# EAGLE design AirSpark_0.9 (EAGLE 7.2.0)
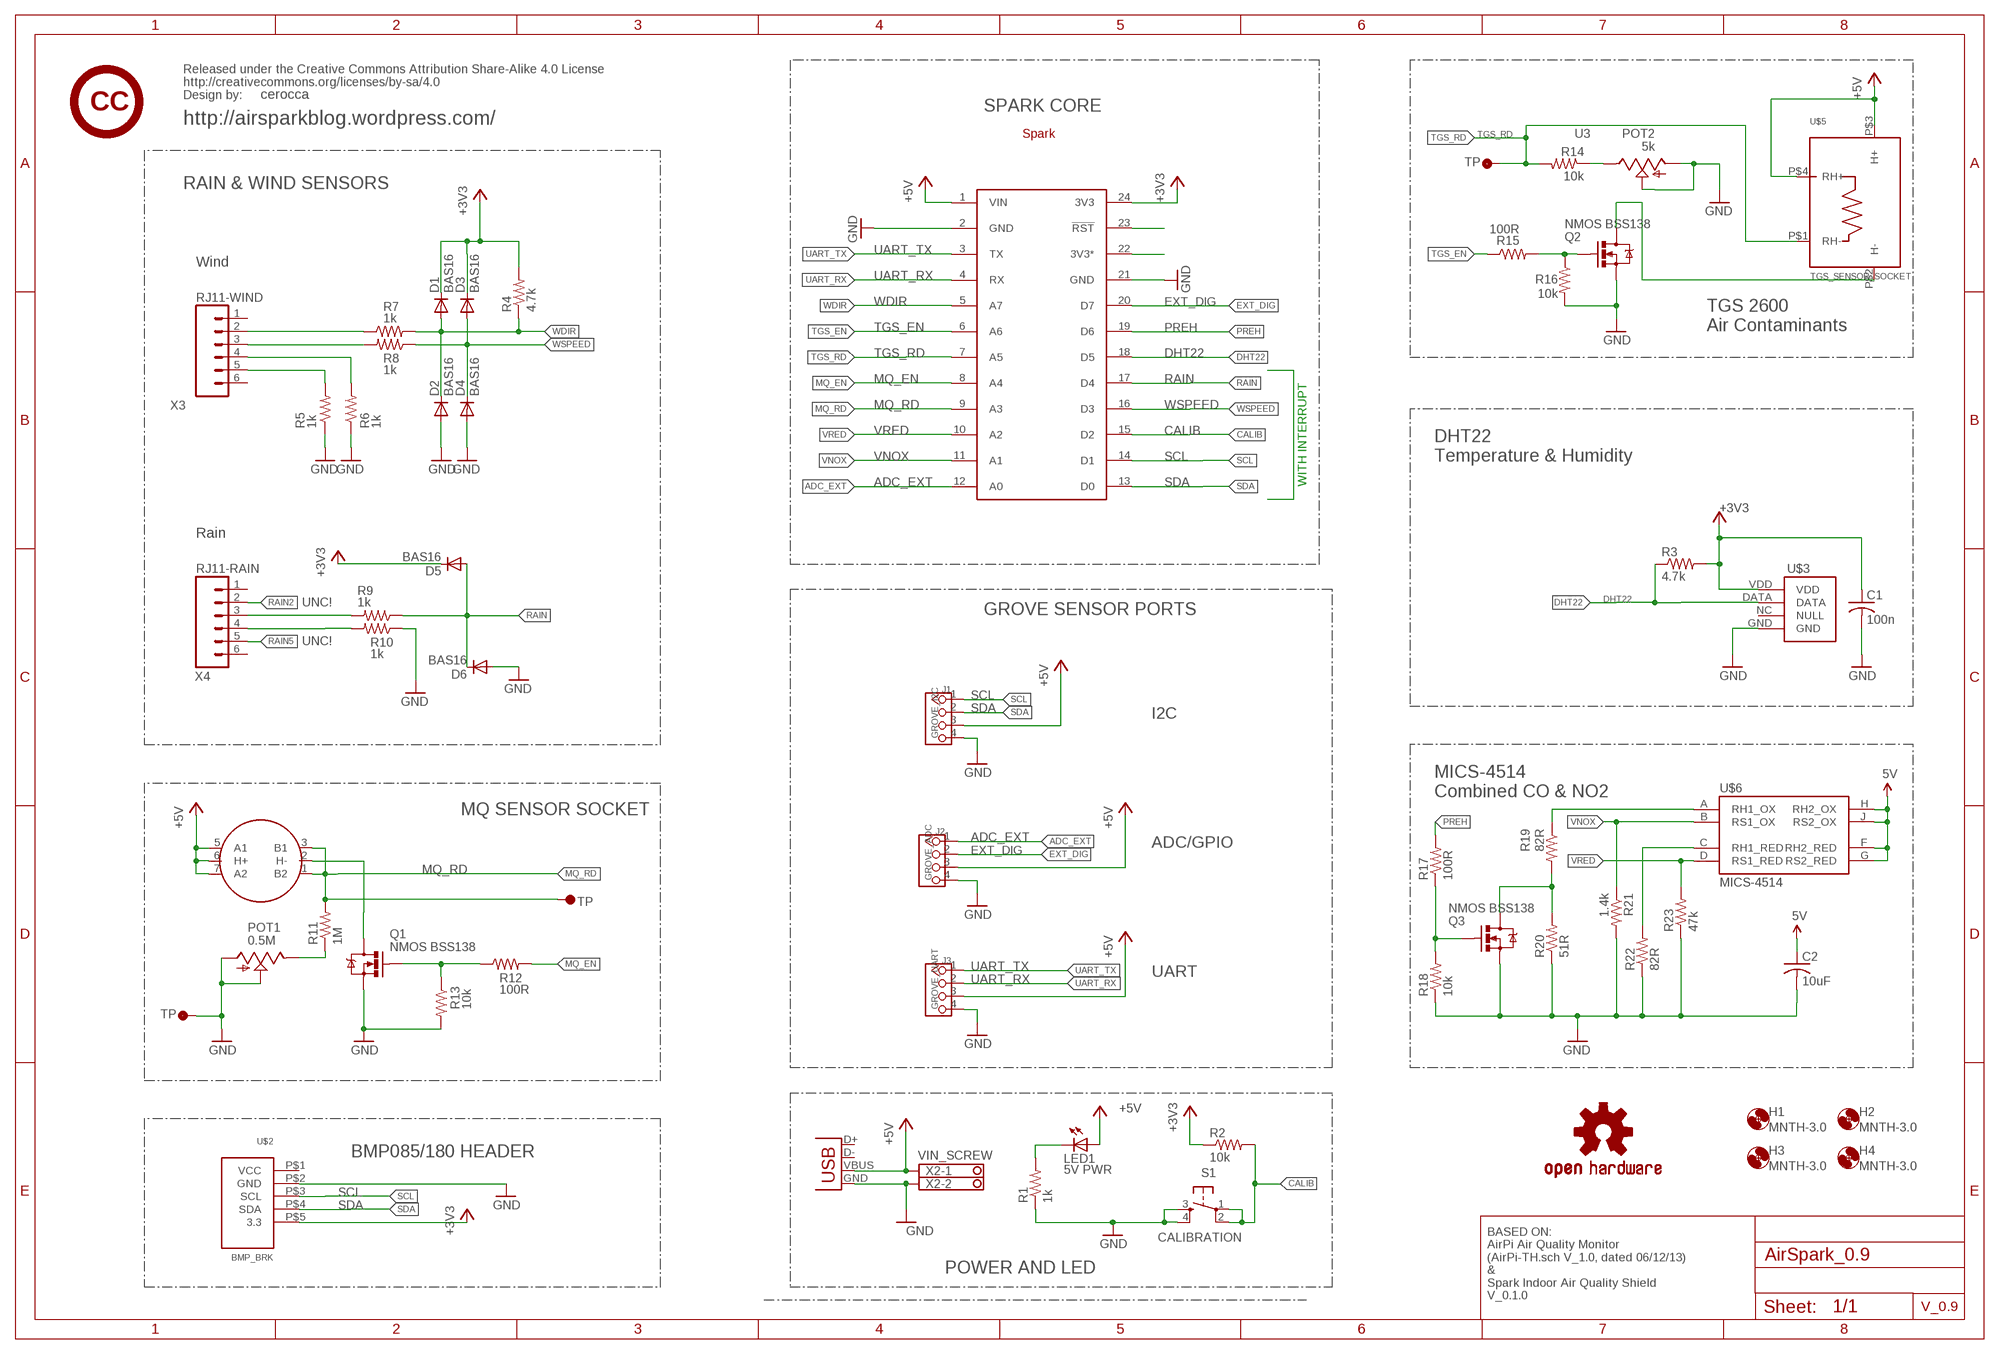
[diagram p0: schematic, sheet 1]

## Parts
C1  100n  C-USC0603  [C0603]
C2  10uF  C-USC0603  [C0603]
D1  BAS16  DIODESOD  [SOD-323]
D2  BAS16  DIODESOD  [SOD-323]
D3  BAS16  DIODESOD  [SOD-323]
D4  BAS16  DIODESOD  [SOD-323]
D5  BAS16  DIODESOD  [SOD-323]
D6  BAS16  DIODESOD  [SOD-323]
H1  MNTH-3.0  MOUNT-HOLE3.0  [3,0]
H2  MNTH-3.0  MOUNT-HOLE3.0  [3,0]
H3  MNTH-3.0  MOUNT-HOLE3.0  [3,0]
H4  MNTH-3.0  MOUNT-HOLE3.0  [3,0]
J1  GROVE_I2C  TWIG-4P-2.0-2.0  [4P-2.0]
J2  GROVE_ADC  TWIG-4P-2.0-2.0  [4P-2.0]
J3  GROVE_UART  TWIG-4P-2.0-2.0  [4P-2.0]
LED1  5V PWR  LED3MM  [LED3MM]
LOGO101  OSHW-LOGOL  [OSHW-LOGO-L]
POT1  0.5M  TRIM_US-B25P  [B25P]
POT2  5k  TRIM_US-B25P  [B25P]
Q1  NMOS BSS138  MOSFET-NCHANNELSMD  [SOT23-3]
Q2  NMOS BSS138  MOSFET-NCHANNELSMD  [SOT23-3]
Q3  NMOS BSS138  MOSFET-NCHANNELSMD  [SOT23-3]
R1  1k  R-US_R0603  [R0603]
R2  10k  R-US_R0603  [R0603]
R3  4.7k  R-US_R0603  [R0603]
R4  4.7k  R-US_R0603  [R0603]
R5  1k  R-US_R0603  [R0603]
R6  1k  R-US_R0603  [R0603]
R7  1k  R-US_R0603  [R0603]
R8  1k  R-US_R0603  [R0603]
R9  1k  R-US_R0603  [R0603]
R10  1k  R-US_R0603  [R0603]
R11  1M  R-US_R0603  [R0603]
R12  100R  R-US_R0603  [R0603]
R13  10k  R-US_R0603  [R0603]
R14  10k  R-US_R0603  [R0603]
R15  100R  R-US_R0603  [R0603]
R16  10k  R-US_R0603  [R0603]
R17  100R  R-US_R0603  [R0603]
R18  10k  R-US_R0603  [R0603]
R19  82R  R-US_R0603  [R0603]
R20  51R  R-US_R0603  [R0603]
R21  1.4k  R-US_R0603  [R0603]
R22  82R  R-US_R0603  [R0603]
R23  47k  R-US_R0603  [R0603]
S1  CALIBRATION  TAC_SWITCHPTH  [TACTILE-PTH]
U$1  SPARK_CORECORE  [SPARK_CORE]
U$2  BMP_BRK  [BMP_BRK]
U$3  DHT22  [DHT22]
U$4  MQ_SENSOR_SOCKET  [MQ_SENSOR_SOCKET]
U$5  TGS_SENSOR_SOCKET  TGS  [SR6]
U$6  MICS-4514  [MICS_10-SMD]
U$7  MQ_TP  TESTPAD-PTR  [TESTPAD-PTR]
U$8  TGS_TP  TESTPAD-PTR  [TESTPAD-PTR]
U$9  GND_TP  TESTPAD-PTR  [TESTPAD-PTR]
U$101  CC  [CC]
U$102  CREATIVE_COMMONS  [CREATIVE_COMMONS]
U$103  SPARK_LOGO..  [SPARK_LOGO]
X1  USB-SMD-NS  [USB-MINIB-NOSTOP]
X2  VIN_SCREW  1751248  [1751248]
X3  RJ11-WIND  RJ11-6PTH  [RJ11-6]
X4  RJ11-RAIN  RJ11-6PTH  [RJ11-6]

## Nets
+3V3: C1.1 D1.1(C) D3.1(C) D5.1(C) R2.1 R3.2 R4.2 U$1.24(3V3) U$2.P$5(3.3) U$3.VDD
+5V: C2.1 J1.3 J2.3 J3.3 LED1.A U$1.1(VIN) U$4.5(A1) U$4.6(H+) U$4.7(A2) U$5.P$3(H+) U$5.P$4(RH+) U$6.F(RH2_RED) U$6.G(RS2_RED) U$6.H(RH2_OX) U$6.J(RS2_OX) X1.VBUS X2.1 ; supply symbol labelled 5V
ADC_EXT: J2.1 U$1.12(A0)
CALIB: R2.2 S1.1 S1.2 U$1.15(D2)
DHT22: R3.1 U$1.18(D5) U$3.DATA
EXT_DIG: J2.2 U$1.20(D7)
GND: C1.2 C2.2 D2.2(A) D4.2(A) D6.2(A) J1.4 J2.4 J3.4 POT1.A POT1.S POT2.A POT2.S Q1.2(S) Q2.2(S) Q3.2(S) R1.1 R5.1 R6.1 R10.1 R13.2 R16.2 R18.1 R20.1 R21.2 R22.1 R23.1 S1.3 S1.4 U$1.2(GND) U$1.21(GND) U$2.P$2(GND) U$3.GND U$9.TP X1.GND X2.2
MQ_EN: R12.2 U$1.8(A4)
MQ_RD: R11.2 U$1.9(A3) U$4.1(B2) U$4.3(B1) U$7.TP
N$1: R19.1 U$6.A(RH1_OX)
N$2: POT2.E R14.1
N$3: Q3.1(G) R17.1 R18.2
N$4: R22.2 U$6.C(RH1_RED)
N$6: Q3.3(D) R19.2 R20.2
N$7: Q1.3(D) U$4.2(H-)
N$8: Q2.3(D) U$5.P$2(H-)
N$10: Q1.1(G) R12.1 R13.1
N$18: LED1.K(C) R1.2
N$19: Q2.1(G) R15.2 R16.1
N$29: POT1.E R11.1
N$34: R7.1 X3.2
N$35: R8.2 X3.3
N$36: R9.2 X4.3
N$37: R10.2 X4.4
N$38: R5.2 X3.5
N$39: R6.2 X3.4
N$48: U$1.23(!RST)
N$49: U$1.22(3V3*)
PREH: R17.2 U$1.19(D6)
RAIN: D5.2(A) D6.1(C) R9.1 U$1.17(D4)
RAIN2: X4.2
RAIN5: X4.5
SCL: J1.1 U$1.14(D1) U$2.P$3(SCL)
SDA: J1.2 U$1.13(D0) U$2.P$4(SDA)
TGS_EN: R15.1 U$1.6(A6)
TGS_RD: R14.2 U$1.7(A5) U$5.P$1(RH-) U$8.TP
UART_RX: J3.2 U$1.4(RX)
UART_TX: J3.1 U$1.3(TX)
VNOX: R21.1 U$1.11(A1) U$6.B(RS1_OX)
VRED: R23.2 U$1.10(A2) U$6.D(RS1_RED)
WDIR: D1.2(A) D2.1(C) R4.1 R7.2 U$1.5(A7)
WSPEED: D3.2(A) D4.1(C) R8.1 U$1.16(D3)
Unconnected: U$2.P$1(VCC) U$3.NC(NULL) X1.D+ X1.D- X3.1 X3.6 X4.1 X4.6

## Notes on the sheet
- cerocca
- SPARK CORE
- http://airsparkblog.wordpress.com/
- U3
- RAIN & WIND SENSORS
- Wind
- TGS 2600
  Air Contaminants
- DHT22
  Temperature & Humidity
- WITH INTERRUPT
- Rain
- U$3
- UNC!
- GROVE SENSOR PORTS
- UNC!
- I2C
- MICS-4514
  Combined CO & NO2
- MQ SENSOR SOCKET
- ADC/GPIO
- UART
- BMP085/180 HEADER
- POWER AND LED
- BASED ON:
  AirPi Air Quality Monitor
  (AirPi-TH.sch V_1.0, dated 06/12/13)
  &
  Spark Indoor Air Quality Shield
  V_0.1.0
- V_0.9

## Library data of the parts
C1 C2 = AirSpark:C-US: CAPACITOR, American symbol
D1-D6 = AirSpark:DIODE: Diode These are standard reverse protection diodes and small signal diodes. SMA package can handle up to about 1A. SOD-323 can handle about 200mA. What the SOD-323 package when ordering, there are some mfgs out there that are 5-pin packages.
H1-H4 = AirSpark:MOUNT-HOLE: MOUNTING HOLE with drill center marker
J1-J3 = AirSpark:TWIG-4P-2.0
LED1 = AirSpark:LED: LED OSRAM: - CHIPLED LG R971, LG N971, LY N971, LG Q971, LY Q971, LO R971, LY R971 LH N974, LH R974 LS Q976, LO Q976, LY Q976 LO Q996 - Hyper CHIPLED LW Q18S LB Q993, LB Q99A, LB R99A - SideLED LS A670, LO A670, LY A670, LG A670, LP A670 LB A673, LV A673, LT A673, LW A673 LH A674 LY A675 LS A676, LA A676, LO A676, LY A676, LW A676 LS A679, LY A679, LG A679 - Hyper Micro SIDELED® LS Y876, LA Y876, LO Y876, LY Y876 LT Y87S - SmartLED LW L88C, LW L88S LB L89C, LB L89S, LG L890 LS L89K, LO L89K, LY L89K LS L896, LA L896, LO L896, LY L896 - TOPLED LS T670, LO T670, LY T670, LG T670, LP T670 LSG T670, LSP T670, LSY T670, LOP T670, LYG T670 LG T671, LOG T671, LSG T671 LB T673, LV T673, LT T673, LW T673 LH T674 LS T676, LA T676, LO T676, LY T676, LB T676, LH T676, LSB T676, LW T676 LB T67C, LV T67C, LT T67C, LS T67K, LO T67K, LY T67K, LW E67C LS E67B, LA E67B, LO E67B, LY E67B, LB E67C, LV E67C, LT E67C LW T67C LS T679, LY T679, LG T679 LS T770, LO T770, LY T770, LG T770, LP T770 LB T773, LV T773, LT T773, LW T773 LH T774 LS E675, LA E675, LY E675, LS T675 LS T776, LA T776, LO T776, LY T776, LB T776 LHGB T686 LT T68C, LB T68C - Hyper Mini TOPLED® LB M676 - Mini TOPLED Santana® LG M470 LS M47K, LO M47K, LY M47K Source: http://www.osram.convergy.de/
LOGO101 = AirSpark:OSHW-LOGO: Open Source Hardware Logo This logo indicates the piece of hardware it is found on incorporates a OSHW license and/or adheres to the definition of open source hardware found here: http://freedomdefined.org/OSHW
POT1 POT2 = AirSpark:TRIM_US-: POTENTIOMETER
Q1-Q3 = AirSpark:MOSFET-NCHANNEL
R1-R23 = AirSpark:R-US_: RESISTOR, American symbol
S1 = AirSpark:TAC_SWITCH: Momentary Switch Button commonly used for reset or general input. Spark Fun Electronics SKU : COM-00097
U$1 = AirSpark:SPARK_CORE
U$2 = AirSpark:BMP_BRK
U$3 = AirSpark:DHT22
U$4 = AirSpark:MQ_SENSOR_SOCKET
U$5 = AirSpark:TGS
U$6 = AirSpark:MICS-4514: Metal oxide MEMS carbon monoxide (CO) and NOx sensor in an SMD package.; PROD_ID: COMP-12310
U$7-U$9 = AirSpark:TESTPAD-PTR
U$101 = AirSpark:CC
U$102 = AirSpark:CREATIVE_COMMONS
U$103 = AirSpark:SPARK_LOGO
X1 = AirSpark:USB
X2 = AirSpark:1751248: MKDS 1/ 2-3,5 Printklemme Nennstrom: 10 A Bemessungsspannung: 160 V Raster: 3,5 mm Polzahl: 2 Montageart: Löten Anschlussart: Schraubanschluss Anschlussrichtung vom Leiter zur Platine: 0° Source: http://eshop.phoenixcontact.com .. 1751248.pdf; OC_FARNELL: unknown; OC_NEWARK: unknown
X3 X4 = AirSpark:RJ11-6: RJ11 Jack Simple 6 pin RJ11 jack. Commonly found on CAT3 devices and Microchip programmers. SKU: PRT-00132

## Net classes
0 Default: width 0.203 mm
1 power: width 0.203 mm, clearance 0.152 mm

## Board
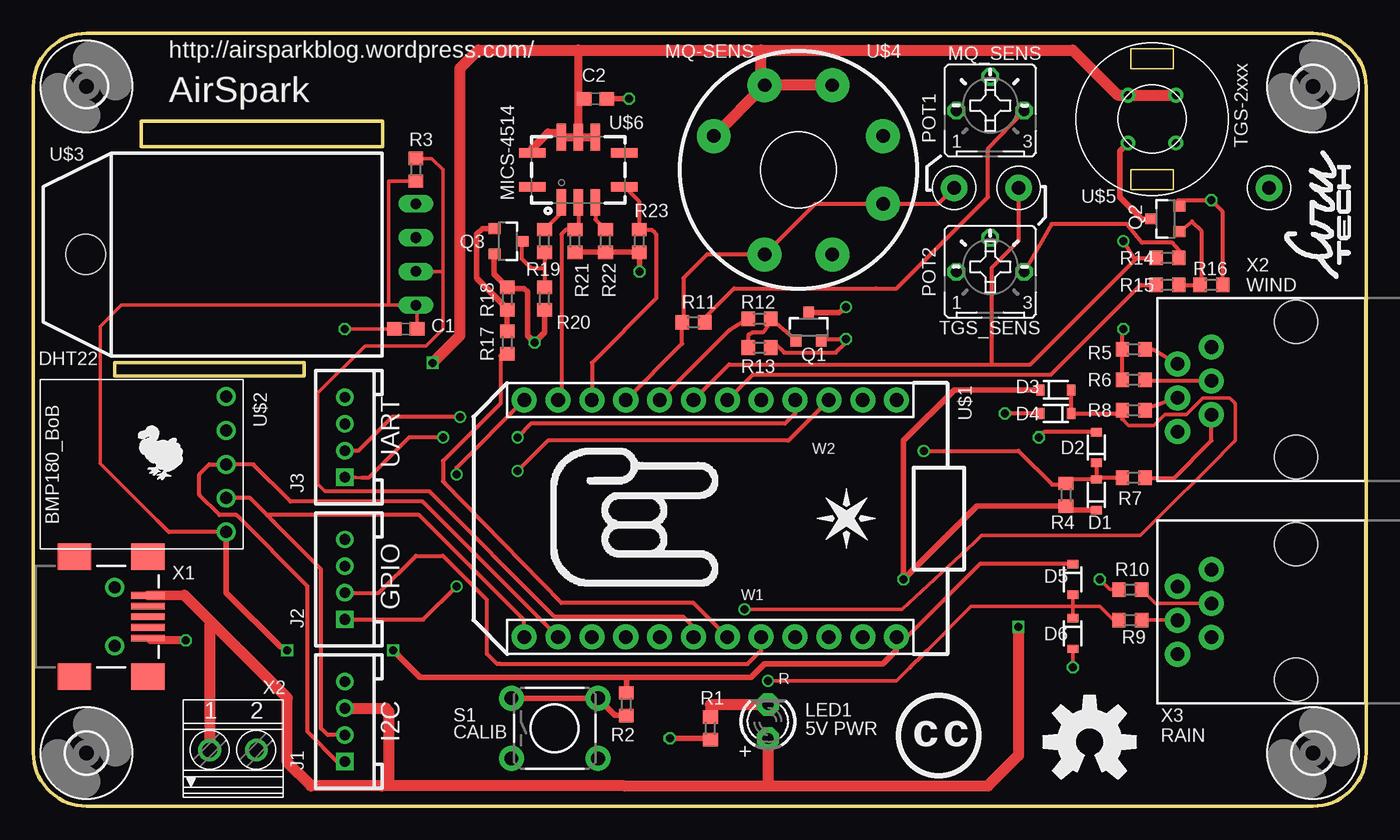
[diagram p1: board, top side]
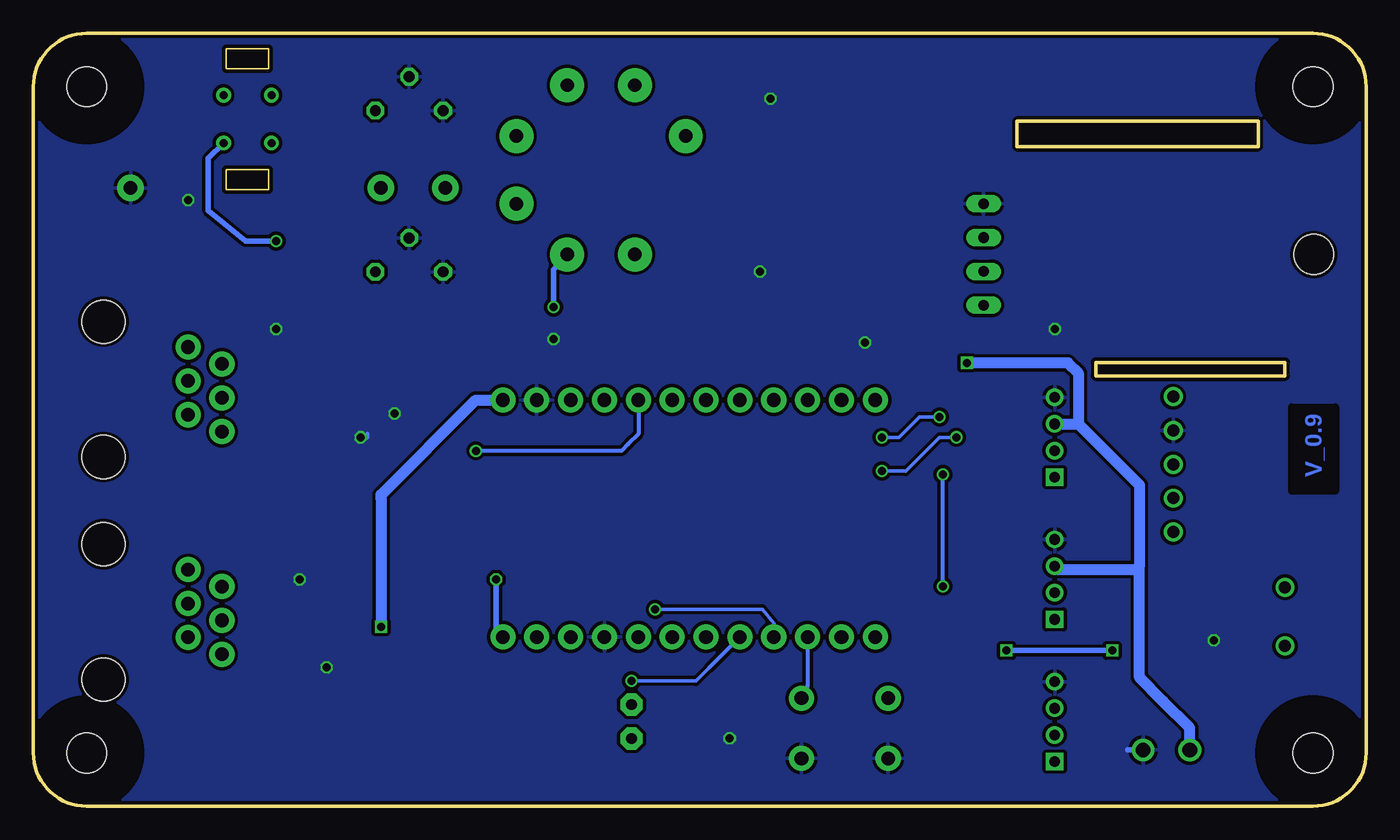
[diagram p2: board, bottom side, seen from below]

Size 100 x 58 mm. Coordinates in mm from the lower left corner, seen from the top.
Outline: 4,0 96,0 arc90 100,4 100,54 arc90 96,58 4,58 arc90 0,54 0,4 arc90 4,0
Outline: 8.1,51.4 26.2,51.4 26.2,49.5 8.1,49.5 8.1,51.4
Outline: 6.1,33.3 20.3,33.3 20.3,32.3 6.1,32.3 6.1,33.3
Copper layers (1*16): Top 0.035mm / dielectric 1.5mm / Bottom 0.035mm
Design rules "SeeedStudio_2layer_DRU_no_angle_20140221": minimum track width 6mil, minimum drill 12mil, track to track 6mil, track to pad 6mil, pad to pad 6mil, via to via 6mil, smd to smd 0mil, copper to edge 10mil, drill to drill 10mil, minimum pad ring 10mil, minimum via ring 6mil, stop-mask expansion 2mil, vias tented up to drill 100mil, thermal gap 10mil
bRestrict: area 2.3,23.6 to 5.6,30

### Footprints (pad centres in the part's own frame; a part is rotated, then mirrored left to right if it is on the bottom)
C0603 = smd 1.1 x 1: 1 -0.85,0; 2 0.85,0
SOD-323 = smd 0.63 x 0.83: 1 -1.15,0; 2 1.15,0
3,0 = hole 3: 0,0
4P-2.0 = drill 0.8 pad 1.27 square: 1 -3,0 | drill 0.8 pad 1.27: 2 -1,0; 3 1,0; 4 3,0
LED3MM = drill 0.813 pad 1.676 octagon: A -1.27,0; K 1.27,0
B25P = drill 0.813 octagon: A -2.54,0; E 2.54,0; S 0,2.54
SOT23-3 = smd 0.8 x 0.9: 1 -0.95,-1; 2 0.95,-1; 3 0,1.1
R0603 = smd 1 x 1.1: 1 -0.85,0; 2 0.85,0
TACTILE-PTH = drill 1.016 pad 1.88: 1 -3.251,2.261; 2 3.251,2.261; 3 -3.251,-2.261; 4 3.251,-2.261
SPARK_CORE = drill 1.016 pad 1.88: 1 -8.89,13.97; 2 -8.89,11.43; 3 -8.89,8.89; 4 -8.89,6.35; 5 -8.89,3.81; 6 -8.89,1.27; 7 -8.89,-1.27; 8 -8.89,-3.81; 9 -8.89,-6.35; 10 -8.89,-8.89; 11 -8.89,-11.43; 12 -8.89,-13.97; 13 8.89,-13.97; 14 8.89,-11.43; 15 8.89,-8.89; 16 8.89,-6.35; 17 8.89,-3.81; 18 8.89,-1.27; 19 8.89,1.27; 20 8.89,3.81; 21 8.89,6.35; 22 8.89,8.89; 23 8.89,11.43; 24 8.89,13.97
BMP_BRK = drill 0.9: P$1 1.27,1.27; P$2 1.27,3.81; P$3 1.27,6.35; P$4 1.27,8.89; P$5 1.27,11.43
DHT22 = drill 0.8 long: DATA -1.27,0; GND 3.81,0; NC 1.27,0; VDD -3.81,0 | hole 3: 0,24.765
MQ_SENSOR_SOCKET = drill 1 pad 2.54: 1 6.35,-2.54; 2 6.35,2.54; 3 2.54,6.35; 4 -2.54,6.35; 5 -6.35,2.54; 6 -6.35,-2.54; 7 -2.54,-6.35
SR6 = drill 0.6: P$1 1.795,1.795; P$2 1.795,-1.795; P$3 -1.795,-1.795; P$4 -1.795,1.795
MICS_10-SMD = smd 0.7 x 2: A 1.27,2.45; B 0,2.45; C -1.27,2.45; F -1.27,-2.45; G 0,-2.45; H 1.27,-2.45 | smd 2 x 0.7: D -3.45,1.27; E -3.45,-1.27; J 3.45,-1.27; K 3.45,1.27
TESTPAD-PTR = drill 1 pad 2: TP 0,0
USB-MINIB-NOSTOP = smd 2.5 x 0.5: D+ 2.5,0; D- 2.5,0.8; GND 2.5,-1.6; ID 2.5,-0.8; VBUS 2.5,1.6 | smd 2.5 x 2: G1 -3,-4.5; G2 -3,4.5; G3 2.5,4.5; G4 2.5,-4.5 | drill 0.9 pad 0.8: H1 0,2.2 | drill 0.9 pad 0.787: H2 0,-2.2
1751248 = drill 1.1 pad 1.7: 1 -1.75,-0.1; 2 1.75,-0.1
RJ11-6 = drill 1.016 pad 1.88: 1 1.905,8.89; 2 3.175,6.35; 3 4.445,8.89; 4 5.715,6.35; 5 6.985,8.89; 6 8.255,6.35 | hole 3.251: 0,0; 10.16,0

### Placement (x,y rotation side)
C1  27.94,35.81 180 top
C2  42.16,53.09 0 top
D1  79.76,23.37 90 top
D2  79.76,26.92 90 top
D3  76.71,31.24 0 top
D4  76.71,29.46 180 top
D5  77.98,17.02 270 top
D6  77.98,12.95 270 top
H1  4,4 0 top
H2  96,4 0 top
H3  96,54 0 top
H4  4,54 0 top
J1  23.37,6.35 90 top
J2  23.37,17.02 90 top
J3  23.37,27.69 90 top
LED1  55.12,6.35 90 top
LOGO101  79.25,4.83 0 top
POT1  71.8,52.2 0 top
POT2  71.8,40.1 0 top
Q1  58.17,35.94 0 top
Q2  84.96,44.07 90 top
Q3  35.6,42.4 270 top
R1  50.8,5.84 90 top
R2  44.49,7.66 270 top
R3  28.7,47.75 270 top
R4  77.47,23.37 270 top
R5  82.55,34.29 0 top
R6  82.55,32 0 top
R7  82.55,24.64 180 top
R8  82.55,29.72 0 top
R9  82.3,13.97 0 top
R10  82.3,16.26 0 top
R11  49.53,36.32 180 top
R12  54.48,36.58 180 top
R13  54.48,34.42 0 top
R14  85.09,41.15 180 top
R15  85.09,39.12 0 top
R16  88.39,39.12 0 top
R17  35.56,34.8 270 top
R18  35.56,38.1 270 top
R19  38.35,42.42 270 top
R20  38.35,38.1 90 top
R21  40.64,42.42 270 top
R22  42.93,42.42 90 top
R23  45.47,42.42 90 top
S1  39.12,5.84 0 top
U$1  50.8,21.59 270 top
U$2  15.75,32 180 top
U$3  28.7,41.4 90 top
U$4  57.4,47.75 270 top
U$5  83.93,51.56 270 top
U$6  40.89,47.75 180 top
U$7  69.09,46.4 0 top
U$8  73.91,46.4 0 top
U$9  92.71,46.4 0 top
U$12  [DOD]  7.37,24.38 0 top
U$101  67.82,5.33 0 top
U$102  20.83,-7.62 0 top  (outside the outline)
U$103  58.72,19.28 0 top
U$104  [CIRU_1X05]  99.6,39.14 90 top
U$105  [ROCKIT]  38.73,26.97 270 top
X1  6.1,14.22 0 top
X2  14.99,4.32 0 top
X3  94.74,26.2 90 top
X4  94.74,9.5 90 top

### Tracks (layer width: path | path; a pad name or v marks a point on that pad's centre or on a via)
+3V3  (via drill 0.6)
  Top 0.254: 9.27,21.46 5,25.73 5,36 6.6,37.6 6.6,37.59 26.67,37.59 | 26.67,37.59 U$3.VDD 28.79,37.5 C1.1 | R3.2 26.67,46.9 26.67,37.59
  Top 0.305: U$2.P$5 10.16,20.57 9.27,21.46 | D5.1 71,18.17 65.53,12.7 U$1.24
  Top 0.406: 64.77,11.94 64.77,11.68 | 64.77,11.68 64.77,11.94 | 44.7,9.65 53.85,9.65 54.86,10.67 62.74,10.67 63.75,10.67 64.77,11.68 | 44.7,9.65 33.53,9.65 29.02,9.65 v26.98,11.68 | v19.05,11.68 18.54,11.94 14.48,16 U$2.P$5 | R2.1 44.49,9.44 44.7,9.65 | D1.1 77.77,22.22 R4.2 70.78,22.52 v65.28,17.02 65.28,27.43 69.09,31.24 D3.1 | 64.77,11.94 U$1.24
  Bottom 0.406: v26.98,11.68 23.11,11.68 19.81,11.68 v19.05,11.68 | v65.28,17.02 65.28,13.21 U$1.24
+5V  (via drill 0.6)
  Top 0.305: 74.17,9.14 73.91,8.89
  Top 0.61: U$6.G U$6.H 39.53,50.55 38.61,50.55 37.44,49.38 U$6.J | U$6.G 40.89,52.67 | 40.89,52.67 C2.1 | 40.89,52.67 40.89,56.74 | U$6.G U$6.F | 52.48,56.74 50.8,56.74
  Top 0.711: X1.VBUS 11.35,15.82
  Top 0.813: 13.46,4.44 X2.1 13.24,13.94 12.95,14.22 | v29.97,33.27 32,35.31 32,55.37 33.37,56.74 40.89,56.74 50.8,56.74 52.48,56.74 54.61,56.74 | 54.61,56.74 77.98,56.74 81.36,53.36 U$5.P$3 U$5.P$4 | 26.16,1.52 44.36,1.52 45.47,1.52 55.12,1.52 | 26.16,1.52 20.83,1.52 19.05,3.3 19.05,8.13 12.95,14.22 | 11.35,15.82 12.95,14.22 | 55.12,1.52 71.63,1.52 73.91,3.81 73.91,6.86 73.91,8.89 v73.91,13.46 | LED1.A 55.12,1.52 | J1.3 26.43,7.35 26.67,7.11 26.67,2.03 26.16,1.52 | U$4.6 U$4.7 | U$4.5 U$4.6 | U$4.6 54.61,54.36 54.61,56.74
  Bottom 0.813: X2.1 13.24,5.87 15.24,7.87 17.02,9.65 17.02,18.03 | v29.97,33.27 23.38,33.27 22.37,33.27 21.6,32.51 21.6,28.69 | J2.3 23.13,17.78 17.27,17.78 17.02,18.03 | U$1.1 66.8,30.48 73.91,23.37 73.91,23.11 v73.91,13.46 | J3.3 21.6,28.69 | 21.6,28.69 17.02,24.1 17.02,18.03
ADC_EXT  (via drill 0.6)
  Top 0.305: J2.1 29.26,14.02 v31.75,16.51 | v31.75,24.89 31.75,25.4 U$1.12
  Bottom 0.305: v31.75,16.51 v31.75,24.89
CALIB
  Top 0.406: S1.1 S1.2 43.66,6.81 R2.2
  Bottom 0.305: U$1.15 41.91,9.07 S1.2
DHT22
  Top 0.254: U$3.DATA 30.73,40.13 | 30.73,40.13 30.73,35.81 29.46,34.54 24.89,34.54 21.34,30.99 21.34,25.54 21.34,24.19 21.9,23.62 | 30.73,40.13 30.73,47.24 30.73,47.75 29.88,48.6 R3.1 28.83,48.73
  Top 0.305: U$1.18 49.53,13.46 48.77,14.22 39.12,14.22 29.72,23.62 21.9,23.62
EXT_DIG
  Top 0.305: U$1.20 54.61,11.68 53.59,10.67 35.05,10.67 34.8,10.67 34.04,11.43 34.04,15.49 30.73,18.8 28.7,18.8 25.92,16.02 J2.2
GND  (via drill 0.6)
  Top 0.254: D6.2 v77.98,10.41 | R10.1 80.77,16.26 v80.01,17.02 | C1.2 v23.37,35.81
  Top 0.305: R6.1 R5.1 81.7,35.73 v81.79,35.81 | D4.2 v72.9,29.46 | Q1.2 59.13,35.05 v60.96,35.05 60.96,34.8 60.2,34.04 59.94,34.04 56.35,34.04 55.59,34.8 R13.2 | Q2.2 85.9,45.47 v88.39,45.47 89.24,44.62 R16.2 | D2.2 75.81,28.07 v75.44,27.69
  Top 0.406: v47.75,5.08 50.8,5.08 R1.1 | R23.1 R22.1 R21.2 45.3,41.57 45.47,41.4 v45.47,40.13 | C2.2 v44.7,53.09 | R20.1 38.35,35.56 v37.59,34.8 37.08,35.31 37.08,35.81 37.08,38.61 36.83,38.86 35.65,38.86 R18.1 34.56,39.95 34.56,41.41 Q3.2
  Top 0.508: 8.77,12.45 X1.GND
  Top 0.61: v11.43,12.45 8.77,12.45
  Bottom 0.305: v75.44,27.69 74.93,27.69 74.93,27.94
  Bottom 0.406: X2.2 17.88,4.22 | 36.12,4.06 S1.3 | U$1.21 57.4,12.7
  pour Bottom (isolate 0.254): 0,0 100,0 100,58 0,58
MQ_EN
  Top 0.305: U$1.8 52.24,35.73 R12.2
MQ_RD
  Top 0.305: U$1.9 48.68,34.71 R11.2 48.77,36.41 48.77,39.62 50.55,41.4 53.76,41.4 U$4.1 58.67,45.21 U$4.3 67.9,45.21 U$7.TP
N$1
  Top 0.305: 39.62,44.54 R19.1
  Top 0.406: U$6.A 39.62,44.54
N$2
  Top 0.305: R14.1 86.23,41.4 85.47,42.29 83.19,42.29 82.04,43.69 77.92,43.69 76.42,43.69 POT2.E
N$3
  Top 0.406: R17.1 R18.2 35.56,37.34 33.78,39.12 33.27,39.62 33.27,42.93 33.7,43.35 Q3.1
N$4
  Top 0.305: U$6.C 42.16,44.03 R22.2
N$6
  Top 0.305: R19.2 38.35,40.39 | 38.35,40.39 R20.2 | 38.35,40.39 37.34,40.39 36.66,41.06 36.66,42.36 Q3.3
N$7  (via drill 0.6)
  Top 0.406: Q1.3 60.45,37.04 v60.96,37.47
  Bottom 0.406: v60.96,37.47 60.96,40.26 U$4.2
N$8
  Top 0.406: Q2.3 83.19,44.07 81.53,45.72 81.53,49.17 U$5.P$2
N$10
  Top 0.305: Q1.1 57.09,35.07 R12.1 55.12,36.87 55.12,36.07 54.74,35.56 53.98,35.56 53.63,35.34 R13.1
N$18
  Top 0.813: LED1.K 50.8,7.62 R1.2
N$19
  Top 0.305: R15.2 R16.1 87.63,39.2 87.63,43.18 86.93,43.88 Q2.1
N$29
  Top 0.305: R11.1 50.55,36.49 50.55,36.83 52.58,38.86 56.9,38.86 63.25,38.86 64.77,38.86 71.63,45.72 71.63,49.34 POT1.E
N$34
  Top 0.305: R7.1 85.6,24.64 88.39,27.43 X3.2
N$35
  Top 0.305: X3.3 83.53,29.84 R8.2
N$36
  Top 0.254: R9.2 84.07,13.97 85.83,13.97 X4.3
N$37
  Top 0.254: 83.27,16.38 R10.2 84.19,15.21 X4.4
N$38
  Top 0.305: R5.2 83.95,34.29 X3.5
N$39
  Top 0.305: X3.4 83.49,31.91 R6.2
PREH
  Top 0.305: U$1.19 49.53,15.24 39.62,15.24 30.86,24.26 30.73,24.38 30.73,25.91 35.05,30.23 35.05,33.78 35.22,33.95 R17.2
RAIN  (via drill 0.6)
  Top 0.254: v55.12,9.4 64.77,9.4 65.79,10.41 | 81.28,13.97 R9.1 81.03,13.97 80.01,14.99 77.98,14.99 | 66.8,11.43 70.36,14.99 77.98,14.99 | D5.2 77.98,15.24 77.98,14.99 | D6.1 77.98,14.99
  Top 0.305: 65.79,10.41 66.8,11.43 67.06,11.68
  Bottom 0.254: 49.28,10.41 50.29,9.4 v55.12,9.4
  Bottom 0.305: U$1.17 49.28,10.41
SCL
  Top 0.305: J1.1 22.81,3.35 20.57,5.59 20.57,11.18 20.57,16.51 15.24,21.84 13.97,21.84 12.45,23.37 12.45,24.89 13.21,25.65 U$2.P$3 16.51,25.65 19.3,22.86 29.21,22.86 U$1.14
SDA
  Top 0.305: J1.2 22.08,5.35 21.59,5.84 21.59,17.78 18.03,21.34 | 18.03,21.34 17.53,21.84 | 17.53,21.84 16.26,23.11 U$2.P$4 | U$1.13 36.83,13.97 28.96,21.84 17.53,21.84 | 17.53,21.84 18.03,21.34
TGS_EN
  Top 0.305: U$1.6 53.98,32.38 76.33,32.38 83.06,39.12 R15.1
TGS_RD  (via drill 0.6)
  Top 0.305: U$1.7 52.2,33.15 71.88,33.15 | 71.88,33.15 74.8,33.15 82.8,41.15 | 82.8,41.15 R14.2 82.8,41.15 | v81.79,42.42 82.55,41.15 82.8,41.15 | U$8.TP 73.91,42.42 71.88,40.39 71.88,33.15
  Bottom 0.406: v81.79,42.42 84.07,42.42 86.87,44.7 86.87,48.62 U$5.P$1
UART_RX  (via drill 0.6)
  Top 0.305: U$1.4 57.15,29.46 56.39,28.7 37.34,28.7 v36.32,27.69 | v32,29.21 26.92,29.21 24.38,26.67 23.38,26.67 J3.2
  Bottom 0.254: v32,29.21 33.53,29.21 35.05,27.69 v36.32,27.69
UART_TX  (via drill 0.6)
  Top 0.254: J3.1 24.18,24.69 24.64,24.64
  Top 0.305: U$1.3 56.64,27.43 38.61,27.43 v36.32,25.15 | v30.73,27.69 28.19,27.69 25.15,24.64 24.64,24.64
  Bottom 0.254: v30.73,27.69 32,27.69 34.54,25.15 v36.32,25.15
VNOX
  Top 0.305: U$6.B 40.89,43.52 | R21.1 39.97,43.27 39.62,42.93 39.62,30.73
  Top 0.406: 40.89,43.52 R21.1 | 39.62,30.73 U$1.11
VRED
  Top 0.305: U$6.D 45.47,45.36 R23.2 46.39,43.27 46.48,43.18 46.74,42.93 46.74,38.1 41.91,33.27 U$1.10
WDIR  (via drill 0.6)
  Top 0.305: R7.2 79.88,24.64 D1.2 | D1.2 77.77,24.52 R4.1 77.38,24.13 76.45,24.13 73.91,26.67 v66.8,26.67 | D2.1 D1.2
  Bottom 0.305: U$1.5 54.61,27.94 55.37,27.18 55.88,26.67 v66.8,26.67
WSPEED  (via drill 0.6)
  Top 0.254: v53.34,14.78 65.18,14.78 70.61,19.81 71.12,20.32 83.06,20.32 84.84,22.1 88.14,25.4 90.17,27.43 90.17,29.46 90.17,30.23 89.75,30.65 87.75,30.65 86.5,29.4 84.9,29.4 84.08,28.57 82.17,28.57 81.7,29.04
  Top 0.305: 81.7,29.46 R8.1 81.7,29.46 | 81.7,29.46 81.7,29.04 | D3.2 D4.1 81.7,29.46
  Bottom 0.254: U$1.16 44.45,13.72 45.31,14.78 v53.34,14.78

### Text on the board
Bottom: V_0.9
tPlace: http://airsparkblog.wordpress.com/ | MQ-SENS | AirSpark | TGS-2xxx | MICS-4514 | X2 / WIND | DHT22 | W2 | UART | BMP180_BoB | GPIO | W1 | R | I2C | CALIB | 5V PWR | X3 / RAIN
tNames: MQ_SENS | U$3 | TGS_SENS | U$2
Measures: 100 mm | 58 mm
tDocu: cerocca